# Altium schematic sheet ao.SchDoc
size A3
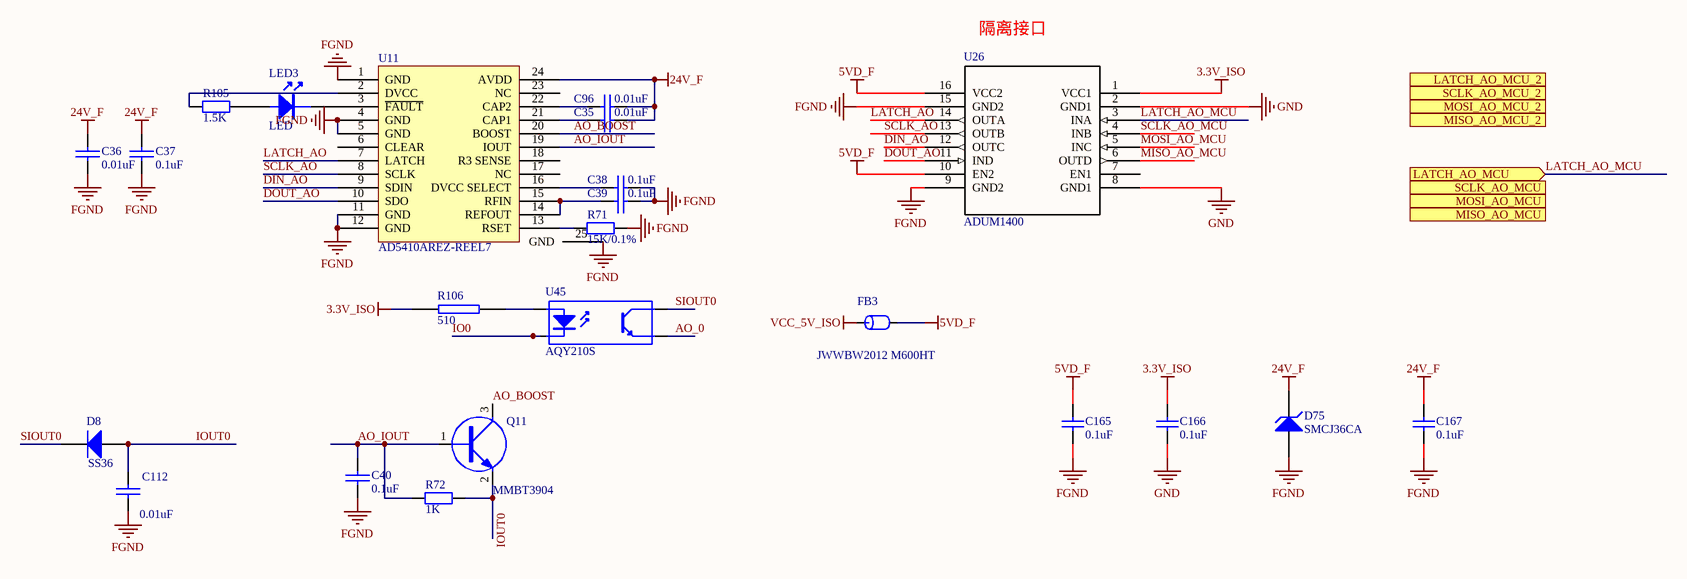
[diagram p0: ao.SchDoc]

## Parts
C35  0.01uF  [0603C]
C36  0.01uF  [0603C]
C37  0.1uF  [0603C]
C38  0.1uF  [0603C]
C39  0.1uF  [0603C]
C40  0.1uF  [0603C]
C96  0.01uF  [0603C]
C112  0.01uF  [0603C]
C165  0.1uF  [0603C]
C166  0.1uF  [0603C]
C167  0.1uF  [0603C]
D8  SS36  [sma]
D75  SMCJ36CA  [SMC]
FB3  JWWBW2012 M600HT  [0805R]
LED3  LED  [0603LED]
Q11  MMBT3904  [SOT23-3]
R71  15K/0.1%  [0603R]
R72  1K  [0603R]
R105  1.5K  [0603R]
R106  510  [0603R]
U11  AD5410AREZ-REEL7  [AD5410AREZ-REEL7]  (no BOM)
U26  ADUM1400  [SOIC16]  (no BOM)
U45  AQY210S  [sop4]

## Ports
LATCH_AO_MCU (in), LATCH_AO_MCU_2 (in), MISO_AO_MCU (out), MISO_AO_MCU_2 (out), MOSI_AO_MCU (in), MOSI_AO_MCU_2 (in), SCLK_AO_MCU (in), SCLK_AO_MCU_2 (in)

## Nets
3.3V_ISO: C166.2 R106.2 U26.1(VCC1)
5VD_F: C165.2 FB3.2 U26.10(EN2) U26.16(VCC2)
24V_F: C35.2 C36.2 C37.2 C96.2 C167.2 D75.2(K) U11.24(AVDD)
FGND: C36.1 C37.1 C38.2 C39.2 C40.1 C112.1 C165.1 C167.1 D75.1(A) R71.2 U11.1(GND) U11.4(GND) U11.5(GND) U11.11(GND) U11.12(GND) U11.25(GND) U26.9(GND2) U26.15(GND2)
GND: C166.1 U26.2(GND1) U26.8(GND1)
VCC_5V_ISO: FB3.1
AO_0: U45.3(E)
AO_BOOST: Q11.3(C) U11.20(BOOST)
AO_IOUT: C40.2 Q11.1(B) R72.1 U11.19(IOUT)
DIN_AO: U11.9(SDIN) U26.12(OUTC)
DOUT_AO: U11.10(SDO) U26.11(IND)
IO0: U45.2(K)
IOUT0: C112.2 D8.1(A) Q11.2(E) R72.2
LATCH_AO: U11.7(LATCH) U26.14(OUTA)
LATCH_AO_MCU: U26.3(INA) ; port LATCH_AO_MCU
MISO_AO_MCU: U26.6(OUTD)
MOSI_AO_MCU: U26.5(INC)
SCLK_AO: U11.8(SCLK) U26.13(OUTB)
SCLK_AO_MCU: U26.4(INB)
SIOUT0: D8.2(K) U45.4(C)
NetC35_1: C35.1 U11.21(CAP1)
NetC38_1: C38.1 U11.16(DVCC_SELECT)
NetC39_1: C39.1 U11.14(REFOUT) U11.15(RFIN)
NetC96_1: C96.1 U11.22(CAP2)
NetLED3_1: LED3.1 R105.2
NetLED3_2: LED3.2 U11.3(~{FAULT})
NetR71_1: R71.1 U11.13(RSET)
NetR105_1: R105.1 U11.2(DVCC)
NetR106_1: R106.1 U45.1(A)

Not connected (* = marked no-connect by the designer): U11 6(CLEAR) 17(NC) 18(R3_SENSE) 23(NC); U26 7(EN1)

## Notes on the sheet
- 隔离接口

## Library data of the parts
C35-C40 C96 C112 = CAP: Capacitor
C165-C167 = Cap: Capacitor; Published: 8-Jun-2000; LatestRevisionDate: 17-Jul-2002; LatestRevisionNote: Re-released for DXP Platform.; PackageReference: RAD-0.3; Publisher: Altium Limited; PackageDescription: Radial Cap, Thru-Hole; 2 Leads; 0.3 in Pin Spacing; Value: 0.1uF
D8 = Diode 1N4001: 1 Amp General Purpose Rectifier; Published: 8-Jun-2000; LatestRevisionDate: 17-Jul-2002; LatestRevisionNote: Re-released for DXP Platform.; DatasheetVersion: 1998; PackageVersion: Aug-1999; PackageReference: DO-41; Publisher: Altium Limited; Code_JEDEC: DO-204-AL; ComponentLink1Description: Manufacturer Link; ComponentLink1URL: http://www.fairchildsemi.com/; ComponentLink2Description: Datasheet; ComponentLink2URL: http://www.fairchildsemi.com/ds/1N%2F1N4001.pdf
D75 = D Zener: SMBJ36CA; Published: 8-Jun-2000; LatestRevisionDate: 17-Jul-2002; LatestRevisionNote: Re-released for DXP Platform.; PackageReference: DIODE-0.7; Publisher: Altium Limited
FB3 = FB: Part Field 1: 磁珠/0603/1K ohm/100MHz; FB: BLM18BD102SN1(muRata); Text Field1: FB
Q11 = NPN_MMBT3904
R71 R72 R105 = Res0805M
R106 = RES2
U26 = ISO7241C
U45 = Optoisolator1: 4-Pin Phototransistor Optocoupler; Published: 24-Mar-1999; LatestRevisionDate: 04-Mar-2005; LatestRevisionNote: Sch pins 3 & 4 Swapped.; DatasheetVersion: Nov-2003; PackageReference: DIP-4; Publisher: Altium Limited